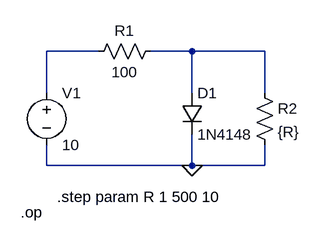
[diagram p0: schematic VOLTAGE REGULATOR.asc]
VOLTAGE REGULATOR.asc, the LTspice schematic file:
Version 4
SHEET 1 880 680
WIRE 192 64 112 64
WIRE 336 64 272 64
WIRE 448 64 336 64
WIRE 112 128 112 64
WIRE 336 128 336 64
WIRE 448 128 448 64
WIRE 112 240 112 208
WIRE 336 240 336 192
WIRE 336 240 112 240
WIRE 448 240 448 208
WIRE 448 240 336 240
FLAG 336 240 0
SYMBOL voltage 112 112 R0
WINDOW 123 0 0 Left 0
WINDOW 39 0 0 Left 0
SYMATTR InstName V1
SYMATTR Value 10
SYMBOL res 288 48 R90
WINDOW 0 0 56 VBottom 2
WINDOW 3 32 56 VTop 2
SYMATTR InstName R1
SYMATTR Value 100
SYMBOL diode 320 128 R0
SYMATTR InstName D1
SYMATTR Value 1N4148
SYMBOL res 432 112 R0
SYMATTR InstName R2
SYMATTR Value {R}
TEXT 128 288 Left 2 !.step param R 1 500 10
TEXT 72 312 Left 2 !.op

The netlist it stands for:
* VOLTAGE REGULATOR.asc
V1 N001 0 10
R1 N002 N001 100
D1 N002 0 1N4148
R2 N002 0 {R}
.model D D
.lib standard.dio
.step param R 1 500 10
.op
.backanno
.end